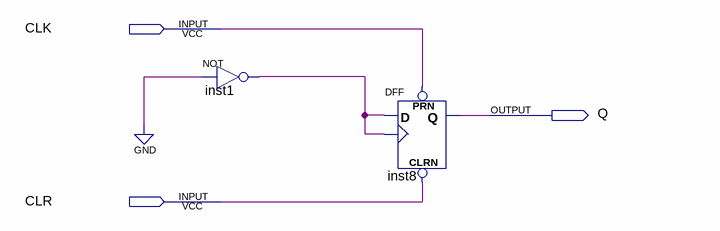
[diagram p0: schematic sheet]
// Quartus schematic ScanHole.bdf as structural Verilog: 2 symbols, 3 pins
module ScanHole (
  input  CLK,
  input  CLR,
  output Q
);

  wire inst1_out;

  not inst1 (inst1_out, 1'b0);
  DFF inst8 (.CLRN(CLR), .CLK(inst1_out), .D(inst1_out), .PRN(CLK), .Q(Q));
endmodule
